# EAGLE design BusCon40 (EAGLE 6.6.0)
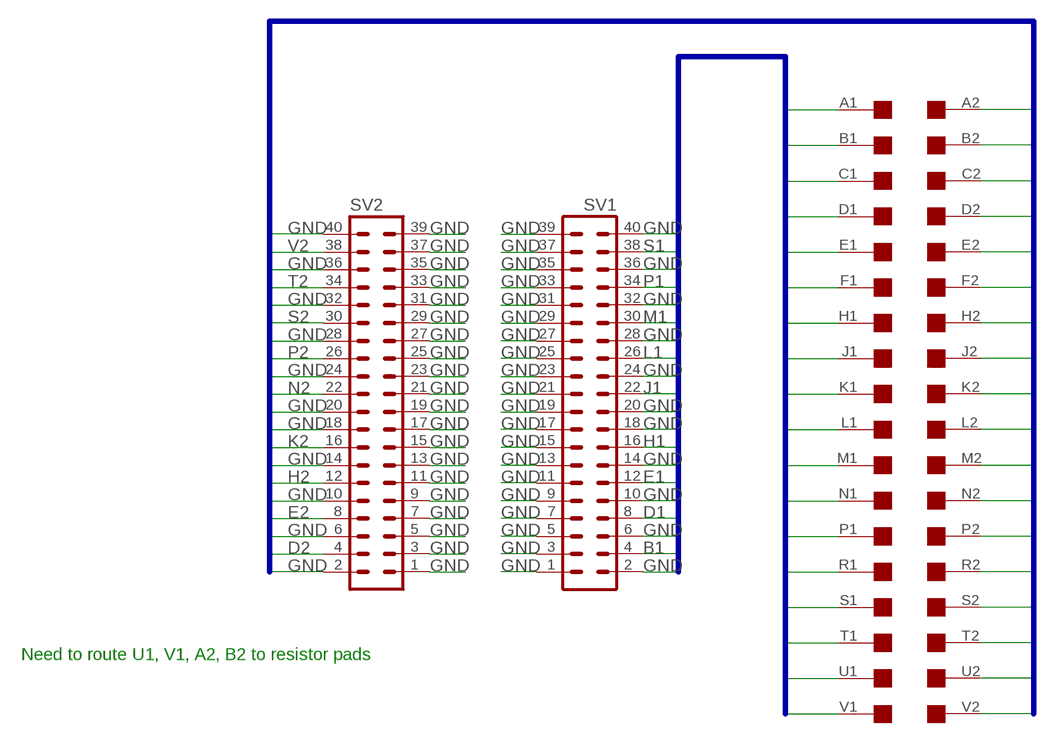
[diagram p0: schematic, sheet 1]

## Parts
SV1  MA20-2W  [MA20-2W]
SV2  MA20-2W  [MA20-2W]
U$1  DEC-FLIPCHIP  [DEC-FLIPCHIP]

## Nets
A2: U$1.A2
B1: SV1.4 U$1.B1
B2: U$1.B2
D1: SV1.8 U$1.D1
D2: SV2.4 U$1.D2
E1: SV1.12 U$1.E1
E2: SV2.8 U$1.E2
GND: SV1.1 SV1.2 SV1.3 SV1.5 SV1.6 SV1.7 SV1.9 SV1.10 SV1.11 SV1.13 SV1.14 SV1.15 SV1.17 SV1.18 SV1.19 SV1.20 SV1.21 SV1.23 SV1.24 SV1.25 SV1.27 SV1.28 SV1.29 SV1.31 SV1.32 SV1.33 SV1.35 SV1.36 SV1.37 SV1.39 SV1.40 SV2.1 SV2.2 SV2.3 SV2.5 SV2.6 SV2.7 SV2.9 SV2.10 SV2.11 SV2.13 SV2.14 SV2.15 SV2.17 SV2.18 SV2.19 SV2.20 SV2.21 SV2.23 SV2.24 SV2.25 SV2.27 SV2.28 SV2.29 SV2.31 SV2.32 SV2.33 SV2.35 SV2.36 SV2.37 SV2.39 SV2.40 U$1.A1 U$1.C1 U$1.C2 U$1.F1 U$1.F2 U$1.J2 U$1.K1 U$1.L2 U$1.M2 U$1.N1 U$1.R1 U$1.R2 U$1.T1 U$1.U2
H1: SV1.16 U$1.H1
H2: SV2.12 U$1.H2
J1: SV1.22 U$1.J1
K2: SV2.16 U$1.K2
L1: SV1.26 U$1.L1
M1: SV1.30 U$1.M1
N2: SV2.22 U$1.N2
P1: SV1.34 U$1.P1
P2: SV2.26 U$1.P2
S1: SV1.38 U$1.S1
S2: SV2.30 U$1.S2
T2: SV2.34 U$1.T2
U1: U$1.U1
V1: U$1.V1
V2: SV2.38 U$1.V2

## Buses
A1,B1,C1,D1,E1,F1,H1,J1,K1,L1,M1,N1,P1,R1,S1,T1,U1,V1
A2,B2,C2,D2,E2,F2,H2,J2,K2,L2,M2,N2,P2,R2,S2,T2,U2,V2

## Notes on the sheet
- Need to route U1, V1, A2, B2 to resistor pads

## Library data of the parts
SV1 SV2 = con-lstb:MA20-2W: PIN HEADER; OC_FARNELL: unknown; OC_NEWARK: unknown
U$1 = con-dec:DEC-FLIPCHIP: DEC Flip-Chip single card fingers

## Board
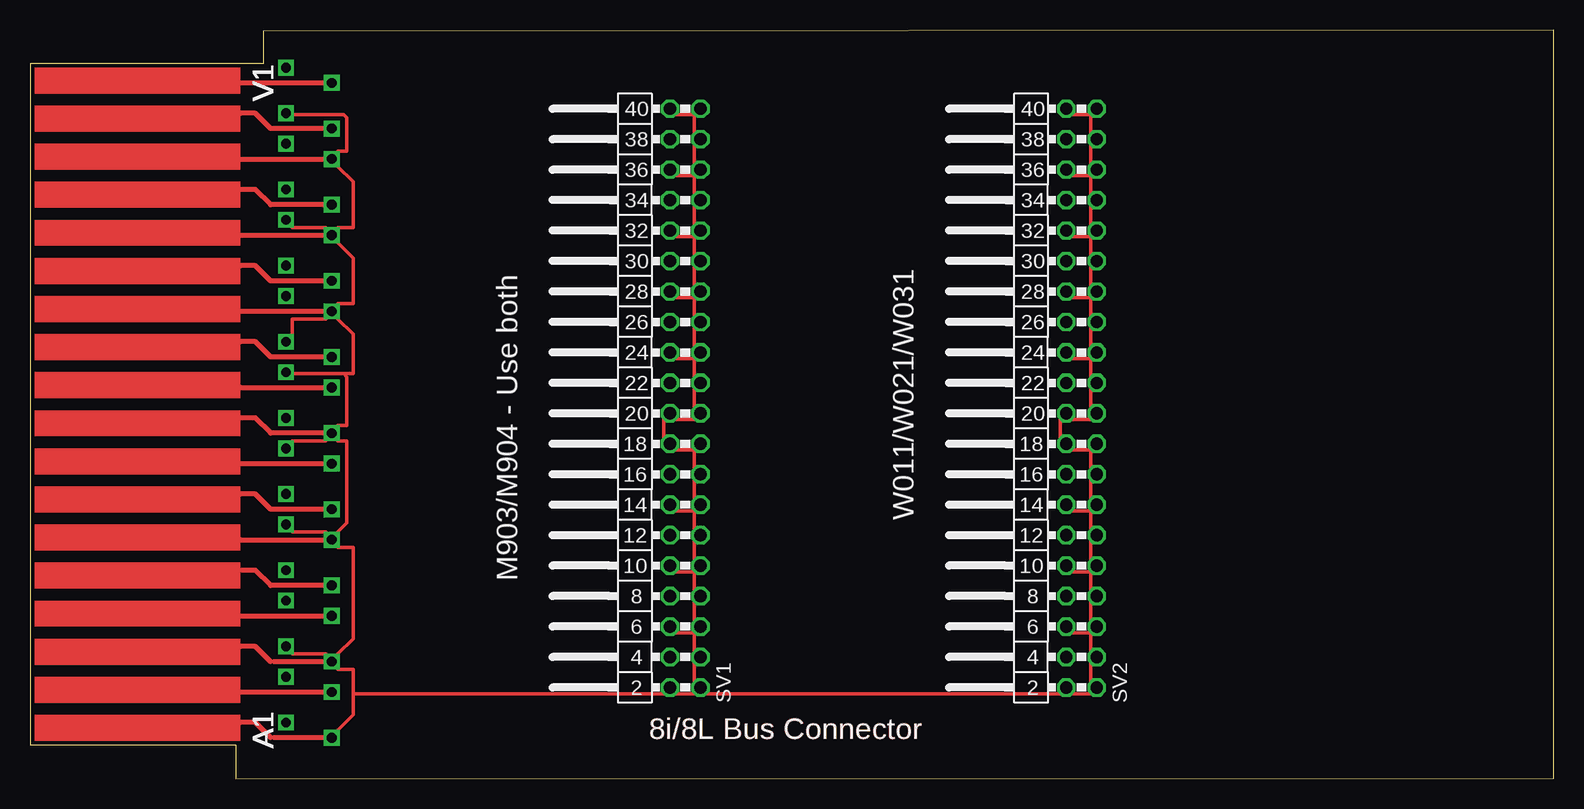
[diagram p1: board, top side]
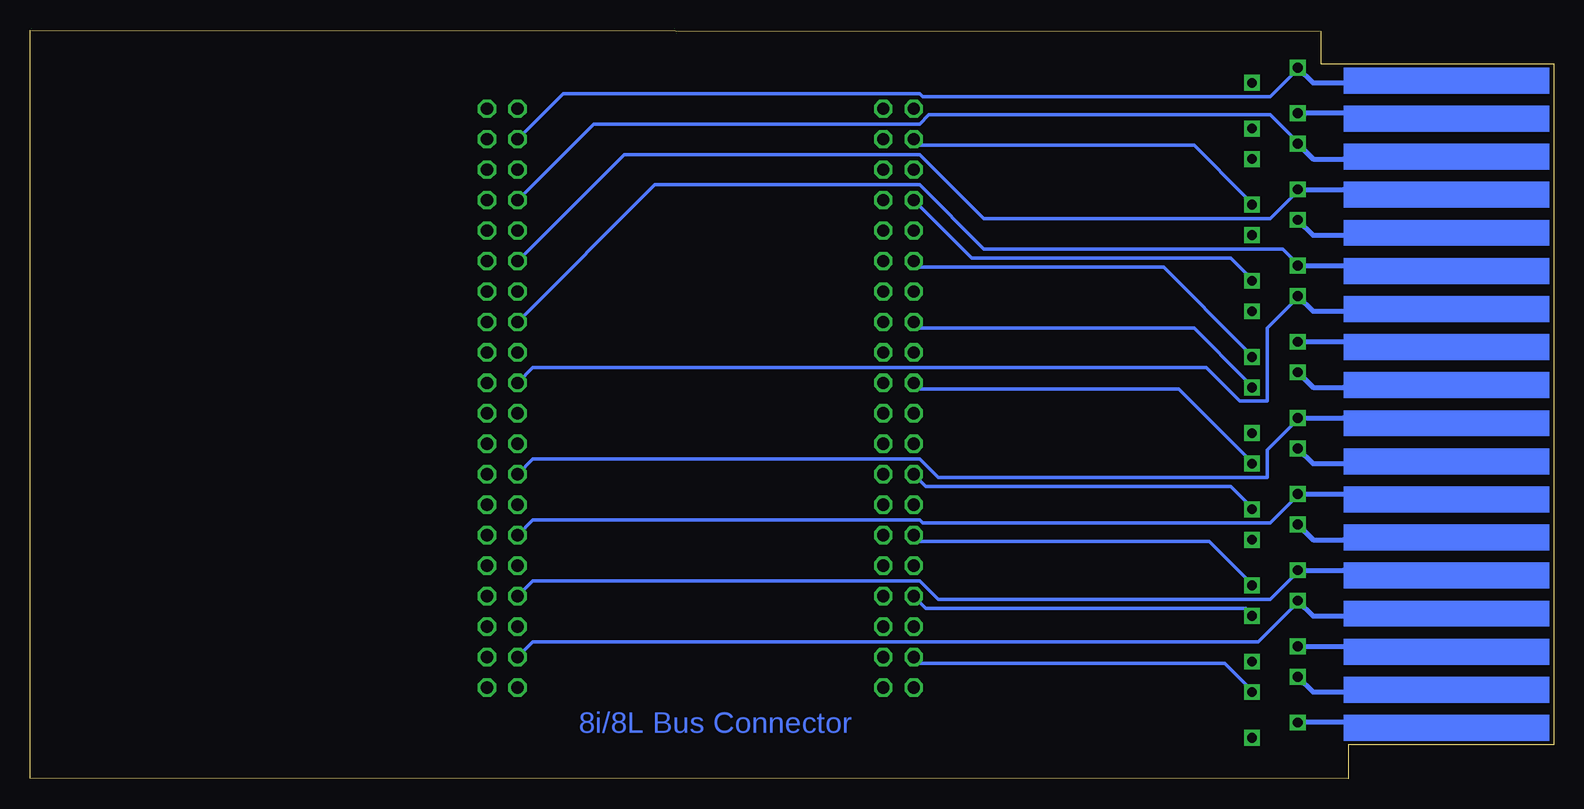
[diagram p2: board, bottom side, seen from below]

Size 126.98 x 62.45 mm. Coordinates in mm from the lower left corner, seen from the top.
Outline: 0,2.83 17.14,2.83 17.14,0 126.98,0.04 126.98,62.45 19.43,62.36 19.43,59.65 0,59.65 0,2.83
Copper layers (1*16): Top 0.035mm / dielectric 1.5mm / Bottom 0.035mm
Design rules "10mils": minimum track width 12mil, minimum drill 28mil, track to track 10mil, track to pad 10mil, pad to pad 10mil, via to via 10mil, smd to smd 10mil, copper to edge 40mil, drill to drill 10mil, minimum pad ring 10mil, minimum via ring 8mil, stop-mask expansion 0mil, vias tented up to drill 0mil, thermal gap 10mil

### Footprints (pad centres in the part's own frame; a part is rotated, then mirrored left to right if it is on the bottom)
MA20-2W = drill 1.016 octagon: 1 -24.13,-1.27; 2 -24.13,1.27; 3 -21.59,-1.27; 4 -21.59,1.27; 5 -19.05,-1.27; 6 -19.05,1.27; 7 -16.51,-1.27; 8 -16.51,1.27; 9 -13.97,-1.27; 10 -13.97,1.27; 11 -11.43,-1.27; 12 -11.43,1.27; 13 -8.89,-1.27; 14 -8.89,1.27; 15 -6.35,-1.27; 16 -6.35,1.27; 17 -3.81,-1.27; 18 -3.81,1.27; 19 -1.27,-1.27; 20 -1.27,1.27; 21 1.27,-1.27; 22 1.27,1.27; 23 3.81,-1.27; 24 3.81,1.27; 25 6.35,-1.27; 26 6.35,1.27; 27 8.89,-1.27; 28 8.89,1.27; 29 11.43,-1.27; 30 11.43,1.27; 31 13.97,-1.27; 32 13.97,1.27; 33 16.51,-1.27; 34 16.51,1.27; 35 19.05,-1.27; 36 19.05,1.27; 37 21.59,-1.27; 38 21.59,1.27; 39 24.13,-1.27; 40 24.13,1.27
DEC-FLIPCHIP = drill 0.813 square: A1 -7.62,27.94; A2 -3.81,26.67; B1 -7.62,24.13; B2 -3.81,22.86; C1 -7.62,21.59; C2 -3.81,20.32; D1 -7.62,17.78; D2 -3.81,16.51; E1 -7.62,15.24; E2 -3.81,13.97; F1 -7.62,11.43; F2 -3.81,10.16; H1 -7.62,8.89; H2 -3.81,7.62; J1 -7.62,5.08; J2 -3.81,3.81; K1 -7.62,2.54; K2 -3.81,1.27; L1 -7.62,-1.27; L2 -3.81,-2.54; M1 -7.62,-3.81; M2 -3.81,-5.08; N1 -7.62,-7.62; N2 -3.81,-8.89; P1 -7.62,-10.16; P2 -3.81,-11.43; R1 -7.62,-13.97; R2 -3.81,-15.24; S1 -7.62,-16.51; S2 -3.81,-17.78; T1 -7.62,-20.32; T2 -3.81,-21.59; U1 -7.62,-22.86; U2 -3.81,-24.13; V1 -7.62,-26.67; V2 -3.81,-27.94

### Placement (x,y rotation side)
SV1  54.6,31.75 90 top
SV2  87.62,31.75 90 top
U$1  17.52,31.37 180 top

### Tracks (layer width: path | path; a pad name or v marks a point on that pad's centre or on a via)
B1
  Bottom 0.305: U$1.B1 25.65,7.87 27.43,9.65 52.83,9.65 SV1.4
D1
  Bottom 0.305: U$1.D1 25.65,14.22 52.32,14.22 SV1.8
D2
  Bottom 0.305: U$1.D2 21.84,14.22 24.63,11.43 85.09,11.43 SV2.4
E1
  Bottom 0.305: U$1.E1 25.65,16.76 28.7,19.81 52.83,19.81 SV1.12
E2
  Bottom 0.305: U$1.E2 21.84,16.76 23.62,14.99 51.3,14.99 52.83,16.51 85.09,16.51 SV2.8
GND
  Top 0.305: 88.39,12.19 86.86,12.19 SV2.6 | 88.39,12.19 88.39,10.67 SV2.3 88.39,9.65 88.39,8.13 SV2.1 88.39,7.11 86.86,7.11 SV2.2 85.85,7.11 56.38,7.11 SV1.1 | 88.39,12.19 SV2.5 88.39,13.21 88.39,14.73 SV2.7 88.39,15.75 88.39,17.27 | 88.39,17.27 86.86,17.27 SV2.10 | 88.39,22.35 86.86,22.35 SV2.14 | 88.39,22.35 88.39,20.83 SV2.11 88.39,19.81 88.39,18.29 SV2.9 88.39,17.27 | 88.39,22.35 SV2.13 88.39,23.37 88.39,24.89 SV2.15 88.39,25.91 88.39,27.43 | 88.39,45.21 86.86,45.21 SV2.32 | 88.39,55.37 86.86,55.37 SV2.40 | 88.39,50.29 86.86,50.29 SV2.36 | 88.39,55.37 88.39,53.85 SV2.37 88.39,52.83 88.39,51.31 SV2.35 88.39,50.29 | 88.39,55.37 SV2.39 | 88.39,50.29 88.39,48.77 SV2.33 88.39,47.75 88.39,46.23 SV2.31 88.39,45.21 | 88.39,27.43 86.86,27.43 SV2.18 85.85,28.45 85.85,29.97 SV2.20 86.86,29.97 88.39,29.97 SV2.19 88.39,30.99 88.39,32.51 SV2.21 88.39,33.53 88.39,35.05 | 88.39,35.05 86.86,35.05 SV2.24 | 88.39,40.13 86.86,40.13 SV2.28 | 88.39,40.13 88.39,38.61 SV2.25 88.39,37.59 88.39,36.07 SV2.23 88.39,35.05 | 88.39,40.13 SV2.27 88.39,41.15 88.39,42.67 SV2.29 88.39,43.69 88.39,45.21 | 88.39,27.43 SV2.17 | SV1.1 55.37,7.11 53.84,7.11 SV1.2 52.83,7.11 26.92,7.11 | SV1.1 55.37,8.13 55.37,9.65 SV1.3 55.37,10.67 55.37,12.19 | 55.37,12.19 53.84,12.19 SV1.6 | 55.37,12.19 SV1.5 55.37,13.21 55.37,14.73 SV1.7 55.37,15.75 55.37,17.27 | 55.37,17.27 53.84,17.27 SV1.10 | 55.37,22.35 53.84,22.35 SV1.14 | 55.37,22.35 55.37,20.83 SV1.11 55.37,19.81 55.37,18.29 SV1.9 55.37,17.27 | 55.37,22.35 SV1.13 55.37,23.37 55.37,24.89 SV1.15 55.37,25.91 55.37,27.43 | 55.37,45.21 53.84,45.21 SV1.32 | 55.37,55.37 53.84,55.37 SV1.40
  Top 0.305: 55.37,50.29 53.84,50.29 SV1.36 | 55.37,55.37 55.37,53.85 SV1.37 55.37,52.83 55.37,51.31 SV1.35 55.37,50.29 | 55.37,55.37 SV1.39 | 55.37,50.29 55.37,48.77 SV1.33 55.37,47.75 55.37,46.23 SV1.31 55.37,45.21 | 55.37,27.43 53.84,27.43 SV1.18 52.83,28.45 52.83,29.97 SV1.20 53.84,29.97 55.37,29.97 SV1.19 55.37,30.99 55.37,32.51 SV1.21 55.37,33.53 55.37,35.05 | 55.37,35.05 53.84,35.05 SV1.24 | 55.37,40.13 53.84,40.13 SV1.28 | 55.37,40.13 55.37,38.61 SV1.25 55.37,37.59 55.37,36.07 SV1.23 55.37,35.05 | 55.37,40.13 SV1.27 55.37,41.15 55.37,42.67 SV1.29 55.37,43.69 55.37,45.21 | 55.37,27.43 SV1.17 | U$1.R2 21.84,45.97 24.63,45.97 U$1.R1 | U$1.R1 25.65,45.97 26.92,45.97 26.92,49.78 25.65,51.05 U$1.T1 25.65,52.32 26.41,52.32 26.41,55.12 26.16,55.37 21.84,55.37 U$1.U2 | U$1.C2 21.84,10.41 24.63,10.41 U$1.C1 | 26.92,7.11 26.92,9.14 25.65,9.14 U$1.C1 | 26.92,7.11 26.92,5.33 25.65,4.06 U$1.A1 | U$1.M2 21.84,37.08 21.84,38.35 24.63,38.35 U$1.N1 | U$1.F2 21.84,20.57 24.63,20.57 U$1.F1 | U$1.J2 21.84,28.19 24.63,28.19 U$1.K1 | 26.16,33.78 21.84,33.78 U$1.L2 | 26.16,33.78 26.41,33.53 26.41,29.46 25.65,29.46 U$1.K1 | U$1.F1 25.65,20.57 26.41,21.34 26.41,28.19 25.65,28.19 U$1.K1 | 26.16,33.78 26.92,33.78 26.92,37.08 25.65,38.35 U$1.N1 | U$1.C1 25.65,10.41 26.92,11.68 26.92,19.3 25.65,19.3 U$1.F1 | U$1.R1 25.65,44.7 26.92,43.43 26.92,39.62 25.65,39.62 U$1.N1
H1
  Bottom 0.305: U$1.H1 25.65,23.11 26.92,24.38 52.32,24.38 SV1.16
H2
  Bottom 0.305: U$1.H2 21.84,23.11 23.62,21.34 52.57,21.34 52.83,21.59 85.09,21.59 SV2.12
J1
  Bottom 0.305: U$1.J1 25.65,26.92 31.24,32.51 52.83,32.51 SV1.22
K2
  Bottom 0.305: U$1.K2 21.84,29.46 23.87,27.43 23.87,25.15 51.3,25.15 52.83,26.67 85.09,26.67 SV2.16
L1
  Bottom 0.305: U$1.L1 25.65,33.27 29.97,37.59 52.83,37.59 SV1.26
M1
  Bottom 0.305: U$1.M1 25.65,35.81 32.51,42.67 52.83,42.67 SV1.30
N2
  Bottom 0.305: U$1.N2 21.84,39.62 23.87,37.59 23.87,31.5 26.16,31.5 28.95,34.29 85.09,34.29 SV2.22
P1
  Bottom 0.305: U$1.P1 25.65,42.16 26.92,43.43 48.51,43.43 SV1.34
P2
  Bottom 0.305: U$1.P2 21.84,43.43 22.6,44.2 47.49,44.2 52.83,49.53 74.93,49.53 SV2.26
S1
  Bottom 0.305: U$1.S1 25.65,48.51 29.97,52.83 52.83,52.83 SV1.38
S2
  Bottom 0.305: U$1.S2 21.84,48.51 23.62,46.74 47.49,46.74 52.83,52.07 77.47,52.07 SV2.30
T2
  Bottom 0.305: U$1.T2 21.84,53.59 23.62,55.37 52.06,55.37 52.83,54.61 80.01,54.61 SV2.34
V2
  Bottom 0.305: U$1.V2 21.84,58.67 23.62,56.9 52.57,56.9 52.83,57.15 82.55,57.15 SV2.38

### Text on the board
Top: 8i/8L Bus Connector
Bottom: 8i/8L Bus Connector
tPlace: W011/W021/W031 | M903/M904 - Use both | 8i/8L Bus Connector
tNames: V1 | V1 | V1 | V1 | V1 | V1 | V1 | V1 | V1 | V1 | V1 | V1 | V1 | V1 | V1 | V1 | V1 | V1 | V1 | V1 | V1 | V1 | V1 | V1 | V1 | V1 | V1 | V1 | V1 | V1 | V1 | V1 | A1 | A1 | A1 | A1 | A1 | A1 | A1 | A1 | A1 | A1 | A1 | A1 | A1 | A1 | A1 | A1 | A1 | A1 | A1 | A1 | A1 | A1 | A1 | A1 | A1 | A1 | A1 | A1 | A1 | A1 | A1 | A1